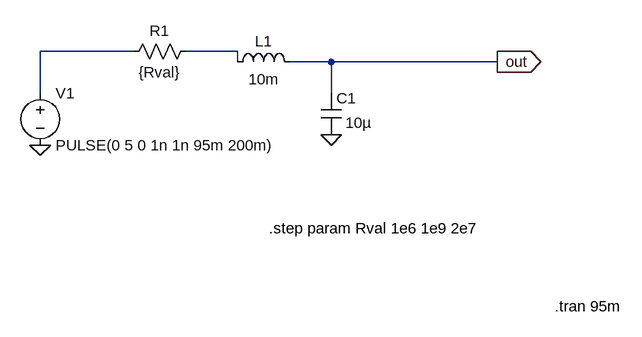
[diagram p0: schematic rlc_open_sweep.asc]
rlc_open_sweep.asc, the LTspice schematic file:
Version 4.1
SHEET 1 880 680
WIRE -688 -1136 -832 -1136
WIRE -528 -1136 -608 -1136
WIRE -528 -1120 -528 -1136
WIRE -384 -1120 -448 -1120
WIRE -128 -1120 -384 -1120
WIRE -832 -1072 -832 -1136
WIRE -384 -1072 -384 -1120
FLAG -832 -992 0
FLAG -384 -1008 0
FLAG -128 -1120 out
IOPIN -128 -1120 Out
SYMBOL voltage -832 -1088 R0
WINDOW 123 0 0 Left 0
WINDOW 39 0 0 Left 0
SYMATTR InstName V1
SYMATTR Value PULSE(0 5 0 1n 1n 95m 200m)
SYMBOL res -592 -1152 R90
WINDOW 0 0 56 VBottom 2
WINDOW 3 32 56 VTop 2
SYMATTR InstName R1
SYMATTR Value {Rval}
SYMBOL ind -544 -1104 R270
WINDOW 0 32 56 VTop 2
WINDOW 3 5 56 VBottom 2
SYMATTR InstName L1
SYMATTR Value 10m
SYMATTR SpiceLine Rser=1m
SYMBOL cap -400 -1072 R0
WINDOW 3 38 46 Left 2
SYMATTR Value 10µ
SYMATTR InstName C1
SYMATTR SpiceLine V=6.3 Irms=0 Rser=4 Lser=0 mfg="AVX" pn="TAJA106M006" type="Tantalum"
TEXT -40 -744 Left 2 !.tran 95m
TEXT -480 -864 Left 2 !.step param Rval 1e6 1e9 2e7

The netlist it stands for:
* rlc_open_sweep.asc
V1 N001 0 PULSE(0 5 0 1n 1n 95m 200m)
R1 N002 N001 {Rval}
L1 N002 out 10m Rser=1m
C1 out 0 10µ V=6.3 Irms=0 Rser=4 Lser=0 mfg="AVX" pn="TAJA106M006" type="Tantalum"
.tran 95m
.step param Rval 1e6 1e9 2e7
.backanno
.end